# Altium schematic sheet BackplaneConnector.SchDoc: =AM_Title
size A3; CompanyName: Antmicro Ltd; Address1: Zwierzyniecka 3; Address2: 60-813 Poznań; Address3: Poland; Address4: 60-813 Poznań, Poland; DocumentNumber: 1; SheetNumber: 1; SheetTotal: 2; PageSetup: Record=PageOptions|CenterHorizontal=True|CenterVertical=True|PrintScale=0.97|XCorrection=1.00|YCorrection=1.00|PrintKind=1|BorderSize=5000000|LeftOffset=0|BottomOffset=0|Orientation=2|PaperLength=2970|PaperWidth=2100|Scale=100|PaperSource=7|PrintQuality=600|MediaType=1|DitherType=10|PaperKind=A4|PrintScaleMode=1
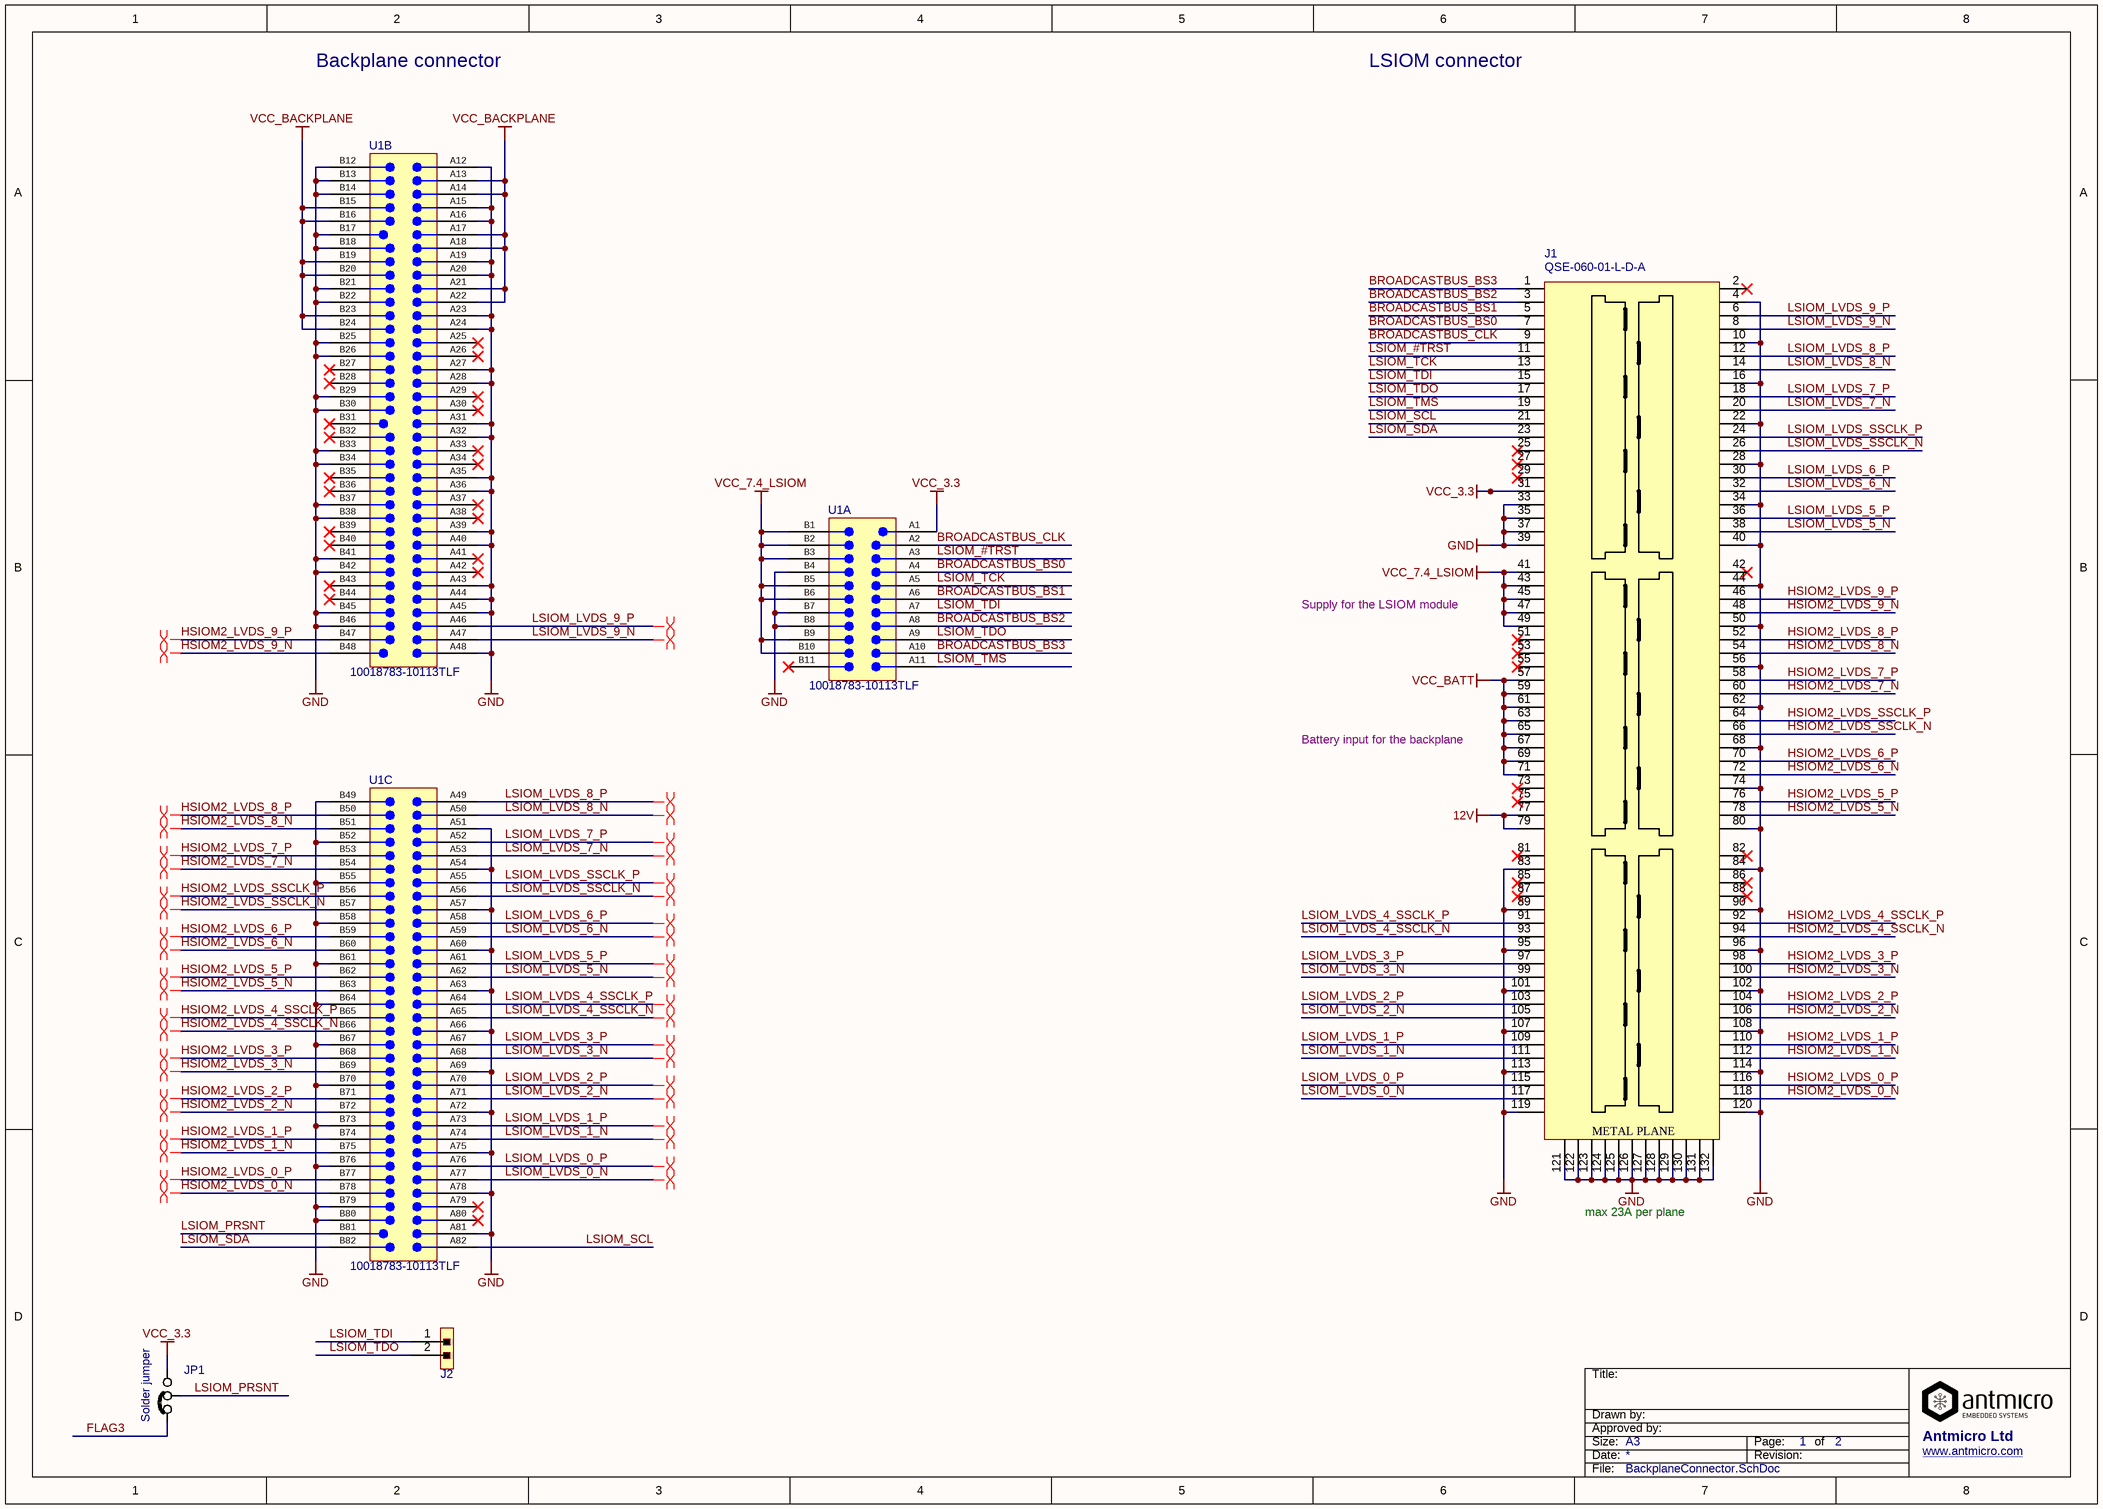
[diagram p0: BackplaneConnector.SchDoc]

## Parts
J1  QSE-060-01-L-D-A  [QSE-060-01-L-D-A]
J2  1x2 pinhead 2.54mm male  [HEADER_1X2_male 2.54mm Angle]  (value not drawn)
JP1  Solder jumper  [JUMPER_2WAY]  (no BOM)
U1  10018783-10113TLF  [10018783-10113TLF]  (parts A,B,C of 3)

## Nets
12V: J1.77 J1.79
GND: J1.4 J1.10 J1.16 J1.22 J1.28 J1.33 J1.34 J1.35 J1.37 J1.39 J1.40 J1.44 J1.50 J1.56 J1.62 J1.68 J1.74 J1.80 J1.83 J1.84 J1.89 J1.90 J1.95 J1.96 J1.101 J1.102 J1.107 J1.108 J1.113 J1.114 J1.119 J1.120 J1.121 J1.122 J1.123 J1.124 J1.125 J1.126 J1.127 J1.128 J1.129 J1.130 J1.131 J1.132 U1.A12 U1.A15 U1.A16 U1.A19 U1.A20 U1.A23 U1.A24 U1.A27 U1.A28 U1.A31 U1.A32 U1.A35 U1.A36 U1.A39 U1.A40 U1.A43 U1.A44 U1.A45 U1.A48 U1.A51 U1.A54 U1.A57 U1.A60 U1.A63 U1.A66 U1.A69 U1.A72 U1.A75 U1.A78 U1.A81 U1.B4 U1.B7 U1.B8 U1.B12 U1.B13 U1.B14 U1.B17 U1.B18 U1.B21 U1.B22 U1.B25 U1.B26 U1.B29 U1.B30 U1.B33 U1.B34 U1.B37 U1.B38 U1.B41 U1.B42 U1.B45 U1.B46 U1.B49 U1.B52 U1.B55 U1.B58 U1.B61 U1.B64 U1.B67 U1.B70 U1.B73 U1.B76 U1.B79 U1.B80
VCC_3.3: J1.31 JP1.3 U1.A1
VCC_7.4_LSIOM: J1.41 J1.43 J1.45 J1.47 J1.49 U1.B1 U1.B2 U1.B3 U1.B5 U1.B6 U1.B9 U1.B10
VCC_BACKPLANE: U1.A13 U1.A14 U1.A17 U1.A18 U1.A21 U1.A22 U1.B15 U1.B16 U1.B19 U1.B20 U1.B23 U1.B24
VCC_BATT: J1.57 J1.59 J1.61 J1.63 J1.65 J1.67 J1.69 J1.71
BROADCASTBUS_BS0: J1.7 U1.A4
BROADCASTBUS_BS1: J1.5 U1.A6
BROADCASTBUS_BS2: J1.3 U1.A8
BROADCASTBUS_BS3: J1.1 U1.A10
BROADCASTBUS_CLK: J1.9 U1.A2
FLAG3: JP1.1
HSIOM2_LVDS_0_N: J1.118 U1.B78
HSIOM2_LVDS_0_P: J1.116 U1.B77
HSIOM2_LVDS_1_N: J1.112 U1.B75
HSIOM2_LVDS_1_P: J1.110 U1.B74
HSIOM2_LVDS_2_N: J1.106 U1.B72
HSIOM2_LVDS_2_P: J1.104 U1.B71
HSIOM2_LVDS_3_N: J1.100 U1.B69
HSIOM2_LVDS_3_P: J1.98 U1.B68
HSIOM2_LVDS_4_SSCLK_N: J1.94 U1.B66
HSIOM2_LVDS_4_SSCLK_P: J1.92 U1.B65
HSIOM2_LVDS_5_N: J1.78 U1.B63
HSIOM2_LVDS_5_P: J1.76 U1.B62
HSIOM2_LVDS_6_N: J1.72 U1.B60
HSIOM2_LVDS_6_P: J1.70 U1.B59
HSIOM2_LVDS_7_N: J1.60 U1.B54
HSIOM2_LVDS_7_P: J1.58 U1.B53
HSIOM2_LVDS_8_N: J1.54 U1.B51
HSIOM2_LVDS_8_P: J1.52 U1.B50
HSIOM2_LVDS_9_N: J1.48 U1.B48
HSIOM2_LVDS_9_P: J1.46 U1.B47
HSIOM2_LVDS_SSCLK_N: J1.66 U1.B57
HSIOM2_LVDS_SSCLK_P: J1.64 U1.B56
LSIOM_#TRST: J1.11 U1.A3
LSIOM_LVDS_0_N: J1.117 U1.A77
LSIOM_LVDS_0_P: J1.115 U1.A76
LSIOM_LVDS_1_N: J1.111 U1.A74
LSIOM_LVDS_1_P: J1.109 U1.A73
LSIOM_LVDS_2_N: J1.105 U1.A71
LSIOM_LVDS_2_P: J1.103 U1.A70
LSIOM_LVDS_3_N: J1.99 U1.A68
LSIOM_LVDS_3_P: J1.97 U1.A67
LSIOM_LVDS_4_SSCLK_N: J1.93 U1.A65
LSIOM_LVDS_4_SSCLK_P: J1.91 U1.A64
LSIOM_LVDS_5_N: J1.38 U1.A62
LSIOM_LVDS_5_P: J1.36 U1.A61
LSIOM_LVDS_6_N: J1.32 U1.A59
LSIOM_LVDS_6_P: J1.30 U1.A58
LSIOM_LVDS_7_N: J1.20 U1.A53
LSIOM_LVDS_7_P: J1.18 U1.A52
LSIOM_LVDS_8_N: J1.14 U1.A50
LSIOM_LVDS_8_P: J1.12 U1.A49
LSIOM_LVDS_9_N: J1.8 U1.A47
LSIOM_LVDS_9_P: J1.6 U1.A46
LSIOM_LVDS_SSCLK_N: J1.26 U1.A56
LSIOM_LVDS_SSCLK_P: J1.24 U1.A55
LSIOM_PRSNT: JP1.2 U1.B81
LSIOM_SCL: J1.21 U1.A82
LSIOM_SDA: J1.23 U1.B82
LSIOM_TCK: J1.13 U1.A5
LSIOM_TDI: J1.15 J2.1 U1.A7
LSIOM_TDO: J1.17 J2.2 U1.A9
LSIOM_TMS: J1.19 U1.A11

Not connected (* = marked no-connect by the designer): J1 2* 25* 27* 29* 42* 51* 53* 55* 73* 75* 81* 82* 85* 86* 87* 88*; U1 A25* A26* A29* A30* A33* A34* A37* A38* A41* A42* A79* A80* B11* B27* B28* B31* B32* B35* B36* B39* B40* B43* B44*

## Layout directives
differential pair; net class LSIOM_LVDS: HSIOM2_LVDS_0_N, HSIOM2_LVDS_0_P, HSIOM2_LVDS_1_N, HSIOM2_LVDS_1_P, HSIOM2_LVDS_2_N, HSIOM2_LVDS_2_P, HSIOM2_LVDS_3_N, HSIOM2_LVDS_3_P, HSIOM2_LVDS_4_SSCLK_N, HSIOM2_LVDS_4_SSCLK_P, HSIOM2_LVDS_5_N, HSIOM2_LVDS_5_P, HSIOM2_LVDS_6_N, HSIOM2_LVDS_6_P, HSIOM2_LVDS_7_N, HSIOM2_LVDS_7_P, HSIOM2_LVDS_8_N, HSIOM2_LVDS_8_P, HSIOM2_LVDS_9_N, HSIOM2_LVDS_9_P, HSIOM2_LVDS_SSCLK_N, HSIOM2_LVDS_SSCLK_P, LSIOM_LVDS_0_N, LSIOM_LVDS_0_P, LSIOM_LVDS_1_N, LSIOM_LVDS_1_P, LSIOM_LVDS_2_N, LSIOM_LVDS_2_P, LSIOM_LVDS_3_N, LSIOM_LVDS_3_P, LSIOM_LVDS_4_SSCLK_N, LSIOM_LVDS_4_SSCLK_P, LSIOM_LVDS_5_N, LSIOM_LVDS_5_P, LSIOM_LVDS_6_N, LSIOM_LVDS_6_P, LSIOM_LVDS_7_N, LSIOM_LVDS_7_P, LSIOM_LVDS_8_N, LSIOM_LVDS_8_P, LSIOM_LVDS_SSCLK_N, LSIOM_LVDS_SSCLK_P
differential pair: LSIOM_LVDS_9_N, LSIOM_LVDS_9_P

## Notes on the sheet
- Backplane connector
- LSIOM connector
- Supply for the LSIOM module
- Battery input for the backplane
- max 23A per plane
- Title:
- Drawn by:
- Size:
- Date:
- Approved by:
- A3
- Revision:
- Page:
- of
- www.antmicro.com
- File:
- (in symbol QSE-060-01-L-D-A) METAL PLANE

## Library data of the parts
J1 = QSE-060-01-L-D-A: SAMTEC 	QSE-60-01-L-D-A  Stacking Board Connector, Dual Row, QSE Series, Receptacle, 0.8 m, 120 Contacts, Surface Mount; Part Number: QSE-060-01-L-D-A; Value: QSE-060-01-L-D-A; Manufacturer: SAMTEC; Part Symbol: QSE-060-01-L-D-A
J2 = HEADER_1X2_male_angle: 1x2 pinhead male angle; Manufacturer: MULTICOMP; Value: 2211S-02G; Part Number: HEADER_1X2_male_angle; Part Symbol: 2211S-02G
JP1 = Jumper 2 way: Value: Solder
U1 = 10018783-10113TLF: PCI Express x16 164 2.36 mm; Manufacturer: AMPHENOL; Part Symbol: 10018783-10113TLF; Part Number: 10018783-10113TLF; Value: 10018783-10113TLF